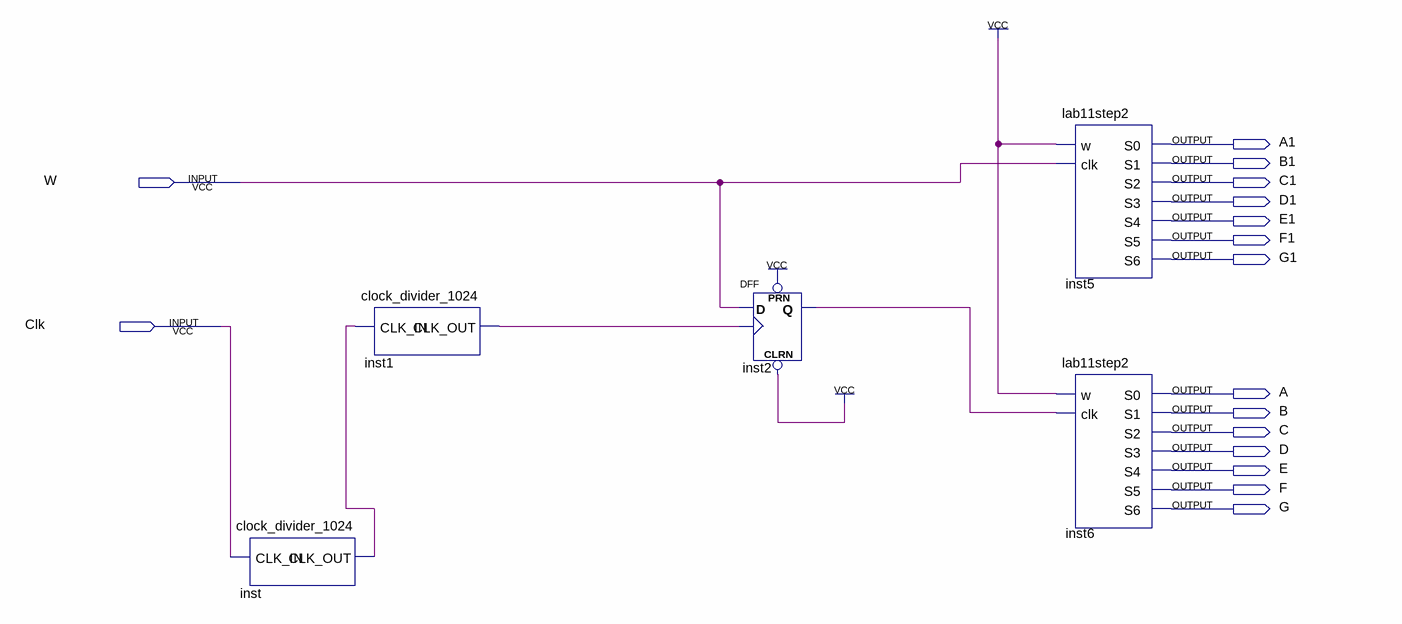
[diagram p0: schematic sheet]
// Quartus schematic lab11step3.bdf as structural Verilog: 5 symbols, 16 pins
module lab11step3 (
  input  W,
  input  Clk,
  output A1,
  output B1,
  output C1,
  output D1,
  output E1,
  output F1,
  output G1,
  output A,
  output B,
  output C,
  output D,
  output E,
  output F,
  output G
);

  wire inst1_clk_out, inst2_q, inst_clk_out;

  clock_divider_1024 inst (.CLK_IN(Clk), .CLK_OUT(inst_clk_out));
  clock_divider_1024 inst1 (.CLK_IN(inst_clk_out), .CLK_OUT(inst1_clk_out));
  DFF inst2 (.CLRN(1'b1), .CLK(inst1_clk_out), .D(W), .PRN(1'b1), .Q(inst2_q));
  lab11step2 inst5 (.w(1'b1), .clk(W), .S0(A1), .S1(B1), .S2(C1), .S3(D1), .S4(E1), .S5(F1), .S6(G1));
  lab11step2 inst6 (.w(1'b1), .clk(inst2_q), .S0(A), .S1(B), .S2(C), .S3(D), .S4(E), .S5(F), .S6(G));
endmodule
